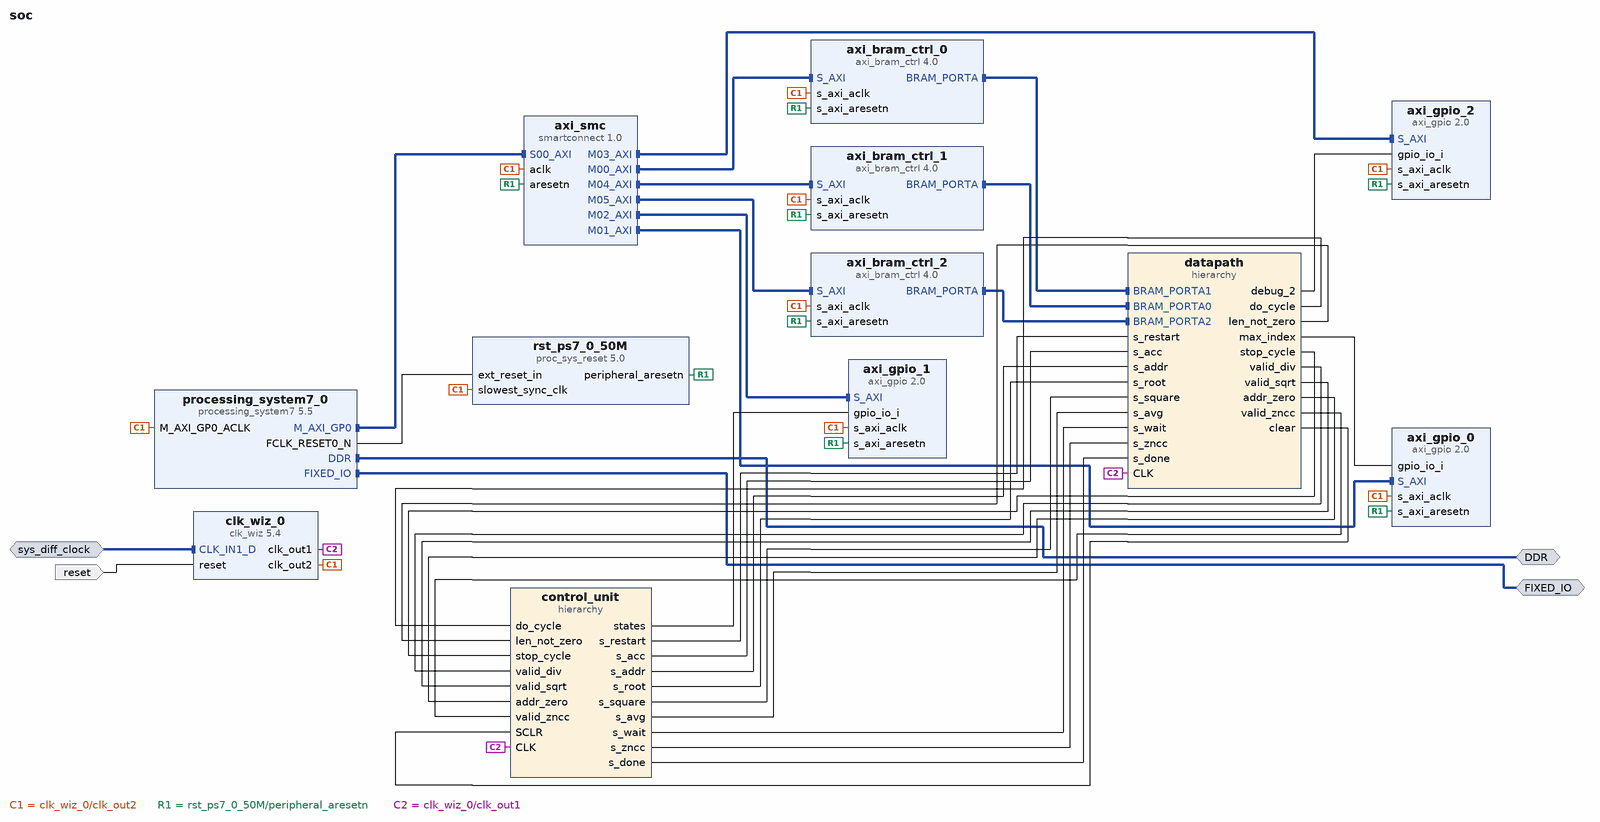
[diagram p0: block diagram of the top level]
# Vivado block design soc, xc7z045ffg900-2, Vivado 2017.3
create_bd_design soc

create_bd_intf_port -mode Master -vlnv xilinx.com:interface:ddrx_rtl:1.0 DDR
create_bd_intf_port -mode Master -vlnv xilinx.com:display_processing_system7:fixedio_rtl:1.0 FIXED_IO
create_bd_intf_port -mode Slave -vlnv xilinx.com:interface:diff_clock_rtl:1.0 sys_diff_clock
set_property -dict {CONFIG.FREQ_HZ 200000000} [get_bd_intf_ports sys_diff_clock]
create_bd_port -dir I -type rst reset
set_property -dict {CONFIG.POLARITY ACTIVE_HIGH} [get_bd_ports reset]

create_bd_cell -type ip -vlnv xilinx.com:ip:processing_system7:5.5 processing_system7_0
set_property -dict [list \
  CONFIG.PCW_UIPARAM_DDR_FREQ_MHZ 533.333313 \
  CONFIG.PCW_APU_PERIPHERAL_FREQMHZ 800 \
  CONFIG.PCW_SDIO_PERIPHERAL_FREQMHZ 50 \
  CONFIG.PCW_UART_PERIPHERAL_FREQMHZ 50 \
  CONFIG.PCW_I2C_PERIPHERAL_FREQMHZ 133.333328 \
  CONFIG.PCW_FPGA1_PERIPHERAL_FREQMHZ 250 \
  CONFIG.PCW_PRESET_BANK0_VOLTAGE {LVCMOS 1.8V} \
  CONFIG.PCW_PRESET_BANK1_VOLTAGE {LVCMOS 1.8V} \
  CONFIG.PCW_UIPARAM_DDR_PARTNO Custom \
  CONFIG.PCW_QSPI_PERIPHERAL_ENABLE 1 \
  CONFIG.PCW_QSPI_QSPI_IO {MIO 1 .. 6} \
  CONFIG.PCW_QSPI_GRP_SINGLE_SS_ENABLE 0 \
  CONFIG.PCW_DUAL_PARALLEL_QSPI_DATA_MODE x8 \
  CONFIG.PCW_QSPI_GRP_IO1_ENABLE 1 \
  CONFIG.PCW_QSPI_GRP_IO1_IO {MIO 0 9 .. 13} \
  CONFIG.PCW_QSPI_GRP_FBCLK_ENABLE 1 \
  CONFIG.PCW_QSPI_GRP_FBCLK_IO {MIO 8} \
  CONFIG.PCW_QSPI_INTERNAL_HIGHADDRESS 0xFDFFFFFF \
  CONFIG.PCW_ENET0_PERIPHERAL_ENABLE 1 \
  CONFIG.PCW_ENET0_ENET0_IO {MIO 16 .. 27} \
  CONFIG.PCW_ENET0_GRP_MDIO_ENABLE 1 \
  CONFIG.PCW_ENET0_GRP_MDIO_IO {MIO 52 .. 53} \
  CONFIG.PCW_ENET_RESET_ENABLE 1 \
  CONFIG.PCW_ENET_RESET_SELECT {Share reset pin} \
  CONFIG.PCW_ENET0_RESET_ENABLE 1 \
  CONFIG.PCW_ENET0_RESET_IO {MIO 47} \
  CONFIG.PCW_SD0_PERIPHERAL_ENABLE 1 \
  CONFIG.PCW_SD0_SD0_IO {MIO 40 .. 45} \
  CONFIG.PCW_SD0_GRP_CD_ENABLE 1 \
  CONFIG.PCW_SD0_GRP_CD_IO {MIO 14} \
  CONFIG.PCW_SD0_GRP_WP_ENABLE 1 \
  CONFIG.PCW_SD0_GRP_WP_IO {MIO 15} \
  CONFIG.PCW_UART1_PERIPHERAL_ENABLE 1 \
  CONFIG.PCW_UART1_UART1_IO {MIO 48 .. 49} \
  CONFIG.PCW_TTC0_PERIPHERAL_ENABLE 1 \
  CONFIG.PCW_TTC0_TTC0_IO EMIO \
  CONFIG.PCW_USB0_PERIPHERAL_ENABLE 1 \
  CONFIG.PCW_USB0_USB0_IO {MIO 28 .. 39} \
  CONFIG.PCW_USB_RESET_ENABLE 1 \
  CONFIG.PCW_USB_RESET_SELECT {Share reset pin} \
  CONFIG.PCW_USB0_RESET_ENABLE 1 \
  CONFIG.PCW_USB0_RESET_IO {MIO 7} \
  CONFIG.PCW_I2C0_PERIPHERAL_ENABLE 1 \
  CONFIG.PCW_I2C0_I2C0_IO {MIO 50 .. 51} \
  CONFIG.PCW_I2C0_GRP_INT_ENABLE 0 \
  CONFIG.PCW_I2C0_RESET_ENABLE 1 \
  CONFIG.PCW_I2C0_RESET_IO {MIO 46} \
  CONFIG.PCW_I2C_RESET_ENABLE 1 \
  CONFIG.PCW_I2C_RESET_SELECT {Share reset pin} \
  CONFIG.PCW_GPIO_MIO_GPIO_ENABLE 1 \
  CONFIG.PCW_GPIO_MIO_GPIO_IO MIO \
  CONFIG.PCW_ENET0_PERIPHERAL_FREQMHZ {100 Mbps} \
  CONFIG.preset ZC706 \
] [get_bd_cells processing_system7_0]
# 235 more settings of processing_system7_0 are not shown: defaults, MIO pin electricals, DDR timing, and values the tool derives
create_bd_cell -type ip -vlnv xilinx.com:ip:axi_bram_ctrl:4.0 axi_bram_ctrl_0
set_property -dict {CONFIG.SINGLE_PORT_BRAM 1} [get_bd_cells axi_bram_ctrl_0]
create_bd_cell -type ip -vlnv xilinx.com:ip:smartconnect:1.0 axi_smc
set_property -dict {CONFIG.NUM_MI 6 CONFIG.NUM_SI 1} [get_bd_cells axi_smc]
create_bd_cell -type ip -vlnv xilinx.com:ip:proc_sys_reset:5.0 rst_ps7_0_50M
create_bd_cell -type ip -vlnv xilinx.com:ip:axi_gpio:2.0 axi_gpio_0
set_property -dict {CONFIG.C_ALL_INPUTS 1} [get_bd_cells axi_gpio_0]
create_bd_cell -type ip -vlnv xilinx.com:ip:axi_gpio:2.0 axi_gpio_1
set_property -dict {CONFIG.C_ALL_INPUTS 1} [get_bd_cells axi_gpio_1]
create_bd_cell -type ip -vlnv xilinx.com:ip:axi_gpio:2.0 axi_gpio_2
set_property -dict {CONFIG.C_ALL_INPUTS 1} [get_bd_cells axi_gpio_2]
create_bd_cell -type ip -vlnv xilinx.com:ip:axi_bram_ctrl:4.0 axi_bram_ctrl_1
set_property -dict {CONFIG.SINGLE_PORT_BRAM 1} [get_bd_cells axi_bram_ctrl_1]
create_bd_cell -type ip -vlnv xilinx.com:ip:clk_wiz:5.4 clk_wiz_0
set_property -dict [list \
  CONFIG.PRIMITIVE MMCM \
  CONFIG.USE_INCLK_SWITCHOVER false \
  CONFIG.SECONDARY_IN_FREQ 100.000 \
  CONFIG.SECONDARY_SOURCE Single_ended_clock_capable_pin \
  CONFIG.CLKIN1_JITTER_PS 50.0 \
  CONFIG.CLKIN2_JITTER_PS 66.660000000000011 \
  CONFIG.CLKOUT2_USED true \
  CONFIG.NUM_OUT_CLKS 2 \
  CONFIG.CLKOUT1_REQUESTED_OUT_FREQ 300 \
  CONFIG.CLKOUT2_REQUESTED_OUT_FREQ 450 \
  CONFIG.PRIM_SOURCE Differential_clock_capable_pin \
  CONFIG.CLKOUT1_DRIVES BUFG \
  CONFIG.CLKOUT2_DRIVES BUFG \
  CONFIG.CLKOUT3_DRIVES BUFG \
  CONFIG.CLKOUT4_DRIVES BUFG \
  CONFIG.CLKOUT5_DRIVES BUFG \
  CONFIG.CLKOUT6_DRIVES BUFG \
  CONFIG.CLKOUT7_DRIVES BUFG \
  CONFIG.FEEDBACK_SOURCE FDBK_AUTO \
  CONFIG.MMCM_DIVCLK_DIVIDE 1 \
  CONFIG.MMCM_CLKFBOUT_MULT_F 4.500 \
  CONFIG.MMCM_CLKIN1_PERIOD 5.000 \
  CONFIG.MMCM_CLKIN2_PERIOD 10.0 \
  CONFIG.MMCM_COMPENSATION ZHOLD \
  CONFIG.MMCM_CLKOUT0_DIVIDE_F 3.000 \
  CONFIG.MMCM_CLKOUT1_DIVIDE 2 \
  CONFIG.USE_BOARD_FLOW true \
  CONFIG.CLK_IN1_BOARD_INTERFACE sys_diff_clock \
  CONFIG.CLK_IN2_BOARD_INTERFACE Custom \
  CONFIG.RESET_BOARD_INTERFACE reset \
  CONFIG.CLKOUT1_JITTER 89.301 \
  CONFIG.CLKOUT1_PHASE_ERROR 91.235 \
  CONFIG.CLKOUT2_JITTER 82.539 \
  CONFIG.CLKOUT2_PHASE_ERROR 91.235 \
] [get_bd_cells clk_wiz_0]
create_bd_cell -type hier control_unit
create_bd_cell -type hier datapath
create_bd_cell -type ip -vlnv xilinx.com:ip:axi_bram_ctrl:4.0 axi_bram_ctrl_2
set_property -dict {CONFIG.SINGLE_PORT_BRAM 1} [get_bd_cells axi_bram_ctrl_2]

# ---- hierarchy /control_unit ----
current_bd_instance /control_unit
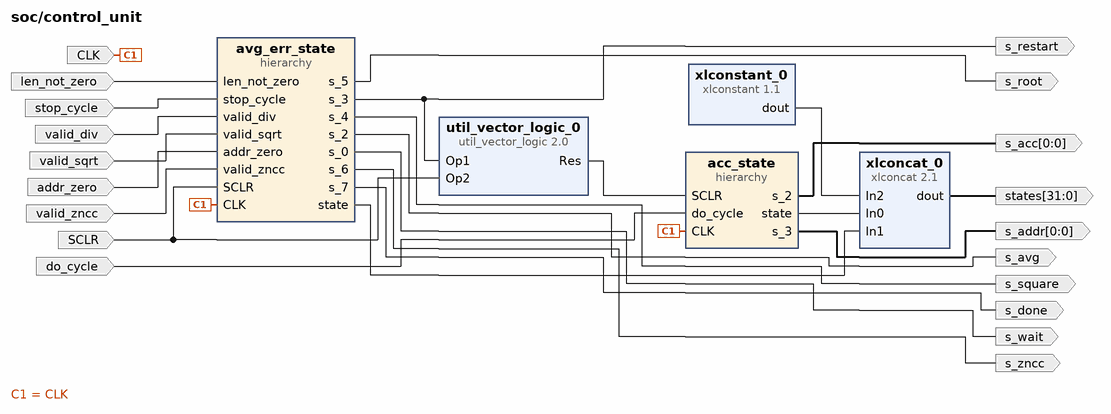
[diagram p1: block diagram inside /control_unit]
create_bd_pin -dir I -type clk CLK
create_bd_pin -dir I -type ce do_cycle
create_bd_pin -dir O s_restart
create_bd_pin -dir O -from 0 -to 0 s_acc
create_bd_pin -dir O -from 0 -to 0 s_addr
create_bd_pin -dir I len_not_zero
create_bd_pin -dir I stop_cycle
create_bd_pin -dir I valid_div
create_bd_pin -dir I valid_sqrt
create_bd_pin -dir O s_root
create_bd_pin -dir O s_square
create_bd_pin -dir O s_avg
create_bd_pin -dir O s_wait
create_bd_pin -dir I addr_zero
create_bd_pin -dir I valid_zncc
create_bd_pin -dir O s_zncc
create_bd_pin -dir O s_done
create_bd_pin -dir I SCLR
create_bd_pin -dir O -from 31 -to 0 states

create_bd_cell -type hier acc_state
create_bd_cell -type hier avg_err_state
create_bd_cell -type ip -vlnv xilinx.com:ip:util_vector_logic:2.0 util_vector_logic_0
set_property -dict {CONFIG.C_SIZE 1 CONFIG.C_OPERATION or} [get_bd_cells util_vector_logic_0]
create_bd_cell -type ip -vlnv xilinx.com:ip:xlconcat:2.1 xlconcat_0
set_property -dict {CONFIG.NUM_PORTS 3 CONFIG.IN0_WIDTH 2 CONFIG.IN1_WIDTH 4 CONFIG.IN2_WIDTH 26} [get_bd_cells xlconcat_0]
create_bd_cell -type ip -vlnv xilinx.com:ip:xlconstant:1.1 xlconstant_0
set_property -dict {CONFIG.CONST_WIDTH 26 CONFIG.CONST_VAL 0} [get_bd_cells xlconstant_0]

# ---- hierarchy /control_unit/acc_state ----
current_bd_instance /control_unit/acc_state
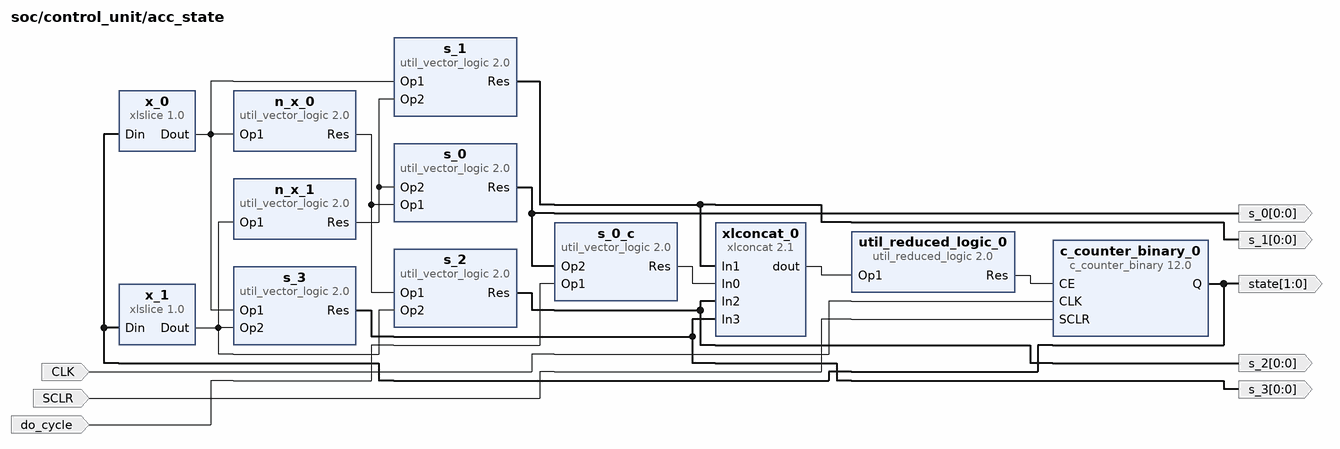
[diagram p2: block diagram inside /control_unit/acc_state]
create_bd_pin -dir I -type clk CLK
create_bd_pin -dir I -type ce do_cycle
create_bd_pin -dir I SCLR
create_bd_pin -dir O -from 0 -to 0 s_0
create_bd_pin -dir O -from 0 -to 0 s_1
create_bd_pin -dir O -from 0 -to 0 s_2
create_bd_pin -dir O -from 0 -to 0 s_3
create_bd_pin -dir O -from 1 -to 0 state

create_bd_cell -type ip -vlnv xilinx.com:ip:c_counter_binary:12.0 c_counter_binary_0
set_property -dict {CONFIG.Output_Width 2 CONFIG.CE true CONFIG.SCLR true} [get_bd_cells c_counter_binary_0]
create_bd_cell -type ip -vlnv xilinx.com:ip:xlslice:1.0 x_0
set_property -dict {CONFIG.DIN_TO 0 CONFIG.DIN_FROM 0 CONFIG.DIN_WIDTH 2} [get_bd_cells x_0]
create_bd_cell -type ip -vlnv xilinx.com:ip:xlslice:1.0 x_1
set_property -dict {CONFIG.DIN_TO 1 CONFIG.DIN_FROM 1 CONFIG.DIN_WIDTH 2 CONFIG.DOUT_WIDTH 1} [get_bd_cells x_1]
create_bd_cell -type ip -vlnv xilinx.com:ip:util_vector_logic:2.0 n_x_0
set_property -dict {CONFIG.C_SIZE 1 CONFIG.C_OPERATION not} [get_bd_cells n_x_0]
create_bd_cell -type ip -vlnv xilinx.com:ip:util_vector_logic:2.0 n_x_1
set_property -dict {CONFIG.C_SIZE 1 CONFIG.C_OPERATION not} [get_bd_cells n_x_1]
create_bd_cell -type ip -vlnv xilinx.com:ip:util_vector_logic:2.0 s_0
set_property -dict {CONFIG.C_SIZE 1 CONFIG.C_OPERATION and} [get_bd_cells s_0]
create_bd_cell -type ip -vlnv xilinx.com:ip:util_vector_logic:2.0 s_1
set_property -dict {CONFIG.C_SIZE 1 CONFIG.C_OPERATION and} [get_bd_cells s_1]
create_bd_cell -type ip -vlnv xilinx.com:ip:util_vector_logic:2.0 s_2
set_property -dict {CONFIG.C_SIZE 1 CONFIG.C_OPERATION and} [get_bd_cells s_2]
create_bd_cell -type ip -vlnv xilinx.com:ip:util_vector_logic:2.0 s_3
set_property -dict {CONFIG.C_SIZE 1 CONFIG.C_OPERATION and} [get_bd_cells s_3]
create_bd_cell -type ip -vlnv xilinx.com:ip:xlconcat:2.1 xlconcat_0
set_property -dict {CONFIG.NUM_PORTS 4} [get_bd_cells xlconcat_0]
create_bd_cell -type ip -vlnv xilinx.com:ip:util_reduced_logic:2.0 util_reduced_logic_0
set_property -dict {CONFIG.C_SIZE 4 CONFIG.C_OPERATION or} [get_bd_cells util_reduced_logic_0]
create_bd_cell -type ip -vlnv xilinx.com:ip:util_vector_logic:2.0 s_0_c
set_property -dict {CONFIG.C_SIZE 1 CONFIG.C_OPERATION and} [get_bd_cells s_0_c]

# ---- hierarchy /control_unit/avg_err_state ----
current_bd_instance /control_unit/avg_err_state
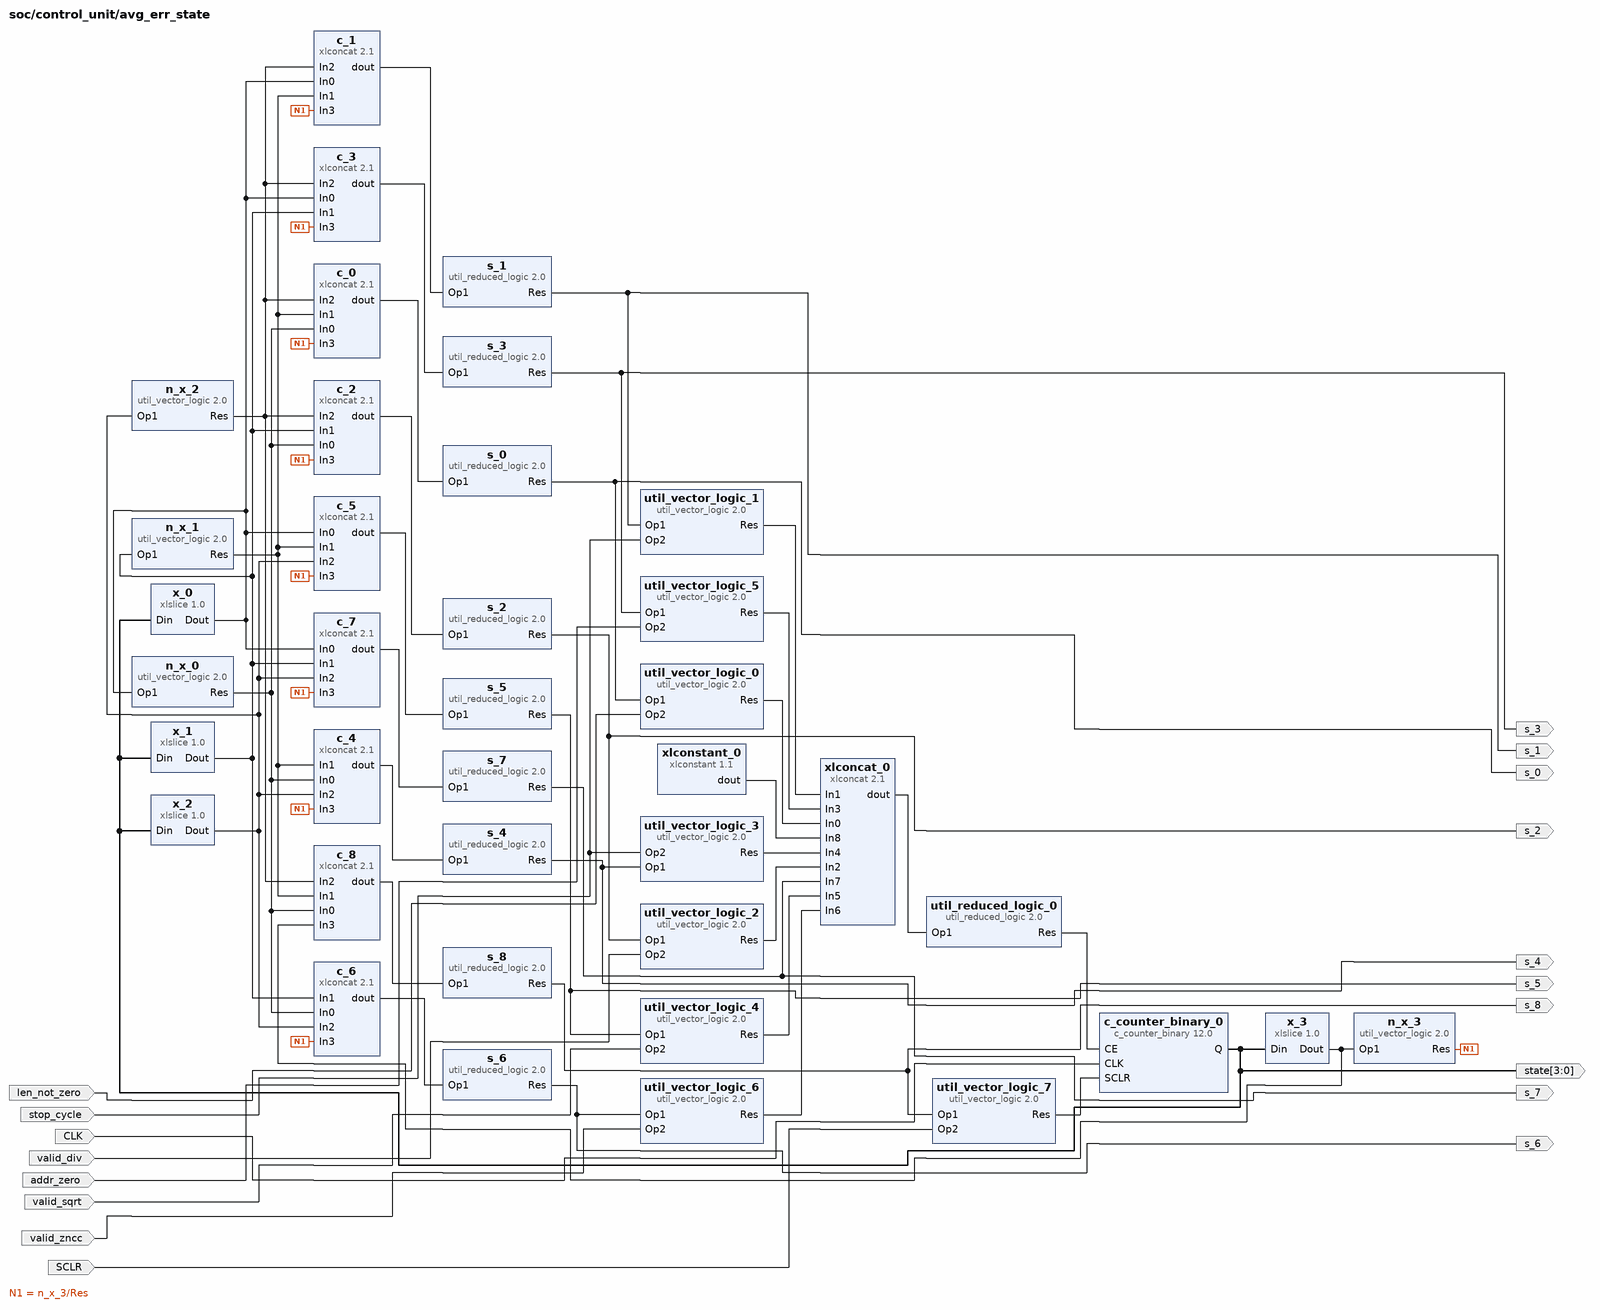
[diagram p3: block diagram inside /control_unit/avg_err_state]
create_bd_pin -dir I -type clk CLK
create_bd_pin -dir I len_not_zero
create_bd_pin -dir I stop_cycle
create_bd_pin -dir I valid_div
create_bd_pin -dir I valid_sqrt
create_bd_pin -dir O s_3
create_bd_pin -dir O s_8
create_bd_pin -dir O s_5
create_bd_pin -dir O s_4
create_bd_pin -dir O s_6
create_bd_pin -dir O s_7
create_bd_pin -dir O s_1
create_bd_pin -dir O s_2
create_bd_pin -dir O s_0
create_bd_pin -dir I addr_zero
create_bd_pin -dir I valid_zncc
create_bd_pin -dir I SCLR
create_bd_pin -dir O -from 3 -to 0 state

create_bd_cell -type ip -vlnv xilinx.com:ip:c_counter_binary:12.0 c_counter_binary_0
set_property -dict [list \
  CONFIG.Output_Width 4 \
  CONFIG.Increment_Value 1 \
  CONFIG.Restrict_Count false \
  CONFIG.CE true \
  CONFIG.SCLR true \
] [get_bd_cells c_counter_binary_0]
create_bd_cell -type ip -vlnv xilinx.com:ip:xlconcat:2.1 c_0
set_property -dict {CONFIG.NUM_PORTS 4} [get_bd_cells c_0]
create_bd_cell -type ip -vlnv xilinx.com:ip:util_reduced_logic:2.0 s_0
set_property -dict {CONFIG.C_SIZE 4 CONFIG.C_OPERATION and} [get_bd_cells s_0]
create_bd_cell -type ip -vlnv xilinx.com:ip:xlconcat:2.1 c_1
set_property -dict {CONFIG.NUM_PORTS 4} [get_bd_cells c_1]
create_bd_cell -type ip -vlnv xilinx.com:ip:util_reduced_logic:2.0 s_1
set_property -dict {CONFIG.C_SIZE 4 CONFIG.C_OPERATION and} [get_bd_cells s_1]
create_bd_cell -type ip -vlnv xilinx.com:ip:xlconcat:2.1 c_2
set_property -dict {CONFIG.NUM_PORTS 4} [get_bd_cells c_2]
create_bd_cell -type ip -vlnv xilinx.com:ip:util_reduced_logic:2.0 s_2
set_property -dict {CONFIG.C_SIZE 4 CONFIG.C_OPERATION and} [get_bd_cells s_2]
create_bd_cell -type ip -vlnv xilinx.com:ip:xlconcat:2.1 c_3
set_property -dict {CONFIG.NUM_PORTS 4} [get_bd_cells c_3]
create_bd_cell -type ip -vlnv xilinx.com:ip:util_reduced_logic:2.0 s_3
set_property -dict {CONFIG.C_SIZE 4 CONFIG.C_OPERATION and} [get_bd_cells s_3]
create_bd_cell -type ip -vlnv xilinx.com:ip:xlconcat:2.1 c_4
set_property -dict {CONFIG.NUM_PORTS 4} [get_bd_cells c_4]
create_bd_cell -type ip -vlnv xilinx.com:ip:util_reduced_logic:2.0 s_4
set_property -dict {CONFIG.C_SIZE 4 CONFIG.C_OPERATION and} [get_bd_cells s_4]
create_bd_cell -type ip -vlnv xilinx.com:ip:xlconcat:2.1 c_5
set_property -dict {CONFIG.NUM_PORTS 4} [get_bd_cells c_5]
create_bd_cell -type ip -vlnv xilinx.com:ip:util_reduced_logic:2.0 s_5
set_property -dict {CONFIG.C_SIZE 4 CONFIG.C_OPERATION and} [get_bd_cells s_5]
create_bd_cell -type ip -vlnv xilinx.com:ip:xlconcat:2.1 c_6
set_property -dict {CONFIG.NUM_PORTS 4} [get_bd_cells c_6]
create_bd_cell -type ip -vlnv xilinx.com:ip:util_reduced_logic:2.0 s_6
set_property -dict {CONFIG.C_SIZE 4 CONFIG.C_OPERATION and} [get_bd_cells s_6]
create_bd_cell -type ip -vlnv xilinx.com:ip:xlconcat:2.1 c_7
set_property -dict {CONFIG.NUM_PORTS 4} [get_bd_cells c_7]
create_bd_cell -type ip -vlnv xilinx.com:ip:util_reduced_logic:2.0 s_7
set_property -dict {CONFIG.C_SIZE 4 CONFIG.C_OPERATION and} [get_bd_cells s_7]
create_bd_cell -type ip -vlnv xilinx.com:ip:xlconcat:2.1 c_8
set_property -dict {CONFIG.NUM_PORTS 4} [get_bd_cells c_8]
create_bd_cell -type ip -vlnv xilinx.com:ip:util_reduced_logic:2.0 s_8
set_property -dict {CONFIG.C_SIZE 4 CONFIG.C_OPERATION and} [get_bd_cells s_8]
create_bd_cell -type ip -vlnv xilinx.com:ip:xlslice:1.0 x_0
set_property -dict {CONFIG.DIN_TO 0 CONFIG.DIN_FROM 0 CONFIG.DIN_WIDTH 4} [get_bd_cells x_0]
create_bd_cell -type ip -vlnv xilinx.com:ip:xlslice:1.0 x_1
set_property -dict {CONFIG.DIN_TO 1 CONFIG.DIN_FROM 1 CONFIG.DIN_WIDTH 4 CONFIG.DOUT_WIDTH 1} [get_bd_cells x_1]
create_bd_cell -type ip -vlnv xilinx.com:ip:xlslice:1.0 x_2
set_property -dict {CONFIG.DIN_TO 2 CONFIG.DIN_FROM 2 CONFIG.DIN_WIDTH 4 CONFIG.DOUT_WIDTH 1} [get_bd_cells x_2]
create_bd_cell -type ip -vlnv xilinx.com:ip:xlslice:1.0 x_3
set_property -dict {CONFIG.DIN_TO 3 CONFIG.DIN_FROM 3 CONFIG.DIN_WIDTH 4 CONFIG.DOUT_WIDTH 1} [get_bd_cells x_3]
create_bd_cell -type ip -vlnv xilinx.com:ip:util_vector_logic:2.0 n_x_0
set_property -dict {CONFIG.C_SIZE 1 CONFIG.C_OPERATION not} [get_bd_cells n_x_0]
create_bd_cell -type ip -vlnv xilinx.com:ip:util_vector_logic:2.0 n_x_1
set_property -dict {CONFIG.C_SIZE 1 CONFIG.C_OPERATION not} [get_bd_cells n_x_1]
create_bd_cell -type ip -vlnv xilinx.com:ip:util_vector_logic:2.0 n_x_3
set_property -dict {CONFIG.C_SIZE 1 CONFIG.C_OPERATION not} [get_bd_cells n_x_3]
create_bd_cell -type ip -vlnv xilinx.com:ip:util_vector_logic:2.0 n_x_2
set_property -dict {CONFIG.C_SIZE 1 CONFIG.C_OPERATION not} [get_bd_cells n_x_2]
create_bd_cell -type ip -vlnv xilinx.com:ip:xlconcat:2.1 xlconcat_0
set_property -dict {CONFIG.NUM_PORTS 9} [get_bd_cells xlconcat_0]
create_bd_cell -type ip -vlnv xilinx.com:ip:util_reduced_logic:2.0 util_reduced_logic_0
set_property -dict {CONFIG.C_SIZE 9 CONFIG.C_OPERATION or} [get_bd_cells util_reduced_logic_0]
create_bd_cell -type ip -vlnv xilinx.com:ip:util_vector_logic:2.0 util_vector_logic_0
set_property -dict {CONFIG.C_SIZE 1} [get_bd_cells util_vector_logic_0]
create_bd_cell -type ip -vlnv xilinx.com:ip:util_vector_logic:2.0 util_vector_logic_1
set_property -dict {CONFIG.C_SIZE 1} [get_bd_cells util_vector_logic_1]
create_bd_cell -type ip -vlnv xilinx.com:ip:util_vector_logic:2.0 util_vector_logic_2
set_property -dict {CONFIG.C_SIZE 1} [get_bd_cells util_vector_logic_2]
create_bd_cell -type ip -vlnv xilinx.com:ip:util_vector_logic:2.0 util_vector_logic_3
set_property -dict {CONFIG.C_SIZE 1} [get_bd_cells util_vector_logic_3]
create_bd_cell -type ip -vlnv xilinx.com:ip:util_vector_logic:2.0 util_vector_logic_4
set_property -dict {CONFIG.C_SIZE 1} [get_bd_cells util_vector_logic_4]
create_bd_cell -type ip -vlnv xilinx.com:ip:util_vector_logic:2.0 util_vector_logic_5
set_property -dict {CONFIG.C_SIZE 1} [get_bd_cells util_vector_logic_5]
create_bd_cell -type ip -vlnv xilinx.com:ip:util_vector_logic:2.0 util_vector_logic_6
set_property -dict {CONFIG.C_SIZE 1} [get_bd_cells util_vector_logic_6]
create_bd_cell -type ip -vlnv xilinx.com:ip:xlconstant:1.1 xlconstant_0
set_property -dict {CONFIG.CONST_WIDTH 1 CONFIG.CONST_VAL 0} [get_bd_cells xlconstant_0]
create_bd_cell -type ip -vlnv xilinx.com:ip:util_vector_logic:2.0 util_vector_logic_7
set_property -dict {CONFIG.C_SIZE 1 CONFIG.C_OPERATION or} [get_bd_cells util_vector_logic_7]

# ---- hierarchy /datapath ----
current_bd_instance /datapath
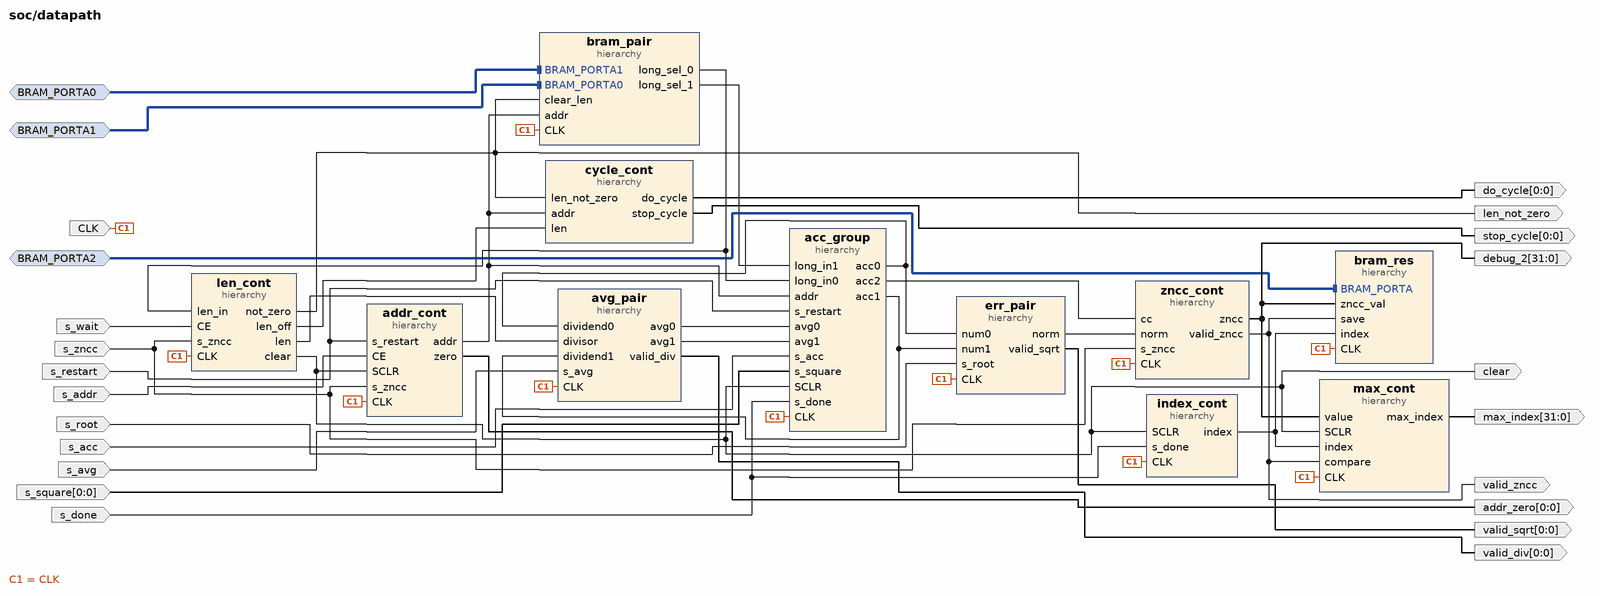
[diagram p4: block diagram inside /datapath]
create_bd_intf_pin -mode Slave -vlnv xilinx.com:interface:bram_rtl:1.0 BRAM_PORTA0
create_bd_intf_pin -mode Slave -vlnv xilinx.com:interface:bram_rtl:1.0 BRAM_PORTA1
create_bd_intf_pin -mode Slave -vlnv xilinx.com:interface:bram_rtl:1.0 BRAM_PORTA2
create_bd_pin -dir O -from 0 -to 0 valid_div
create_bd_pin -dir O -from 0 -to 0 valid_sqrt
create_bd_pin -dir I -type clk CLK
create_bd_pin -dir I s_root
create_bd_pin -dir O -from 0 -to 0 do_cycle
create_bd_pin -dir O -from 0 -to 0 stop_cycle
create_bd_pin -dir O len_not_zero
create_bd_pin -dir O -from 31 -to 0 max_index
create_bd_pin -dir I -type ce s_acc
create_bd_pin -dir I s_restart
create_bd_pin -dir I -from 0 -to 0 -type data s_square
create_bd_pin -dir I s_addr
create_bd_pin -dir O -from 0 -to 0 addr_zero
create_bd_pin -dir I s_wait
create_bd_pin -dir I s_avg
create_bd_pin -dir O -from 31 -to 0 debug_2
create_bd_pin -dir I s_zncc
create_bd_pin -dir O valid_zncc
create_bd_pin -dir I s_done
create_bd_pin -dir O clear

create_bd_cell -type hier cycle_cont
create_bd_cell -type hier addr_cont
create_bd_cell -type hier len_cont
create_bd_cell -type hier bram_pair
create_bd_cell -type hier avg_pair
create_bd_cell -type hier acc_group
create_bd_cell -type hier err_pair
create_bd_cell -type hier zncc_cont
create_bd_cell -type hier bram_res
create_bd_cell -type hier index_cont
create_bd_cell -type hier max_cont

# ---- hierarchy /datapath/cycle_cont ----
current_bd_instance /datapath/cycle_cont
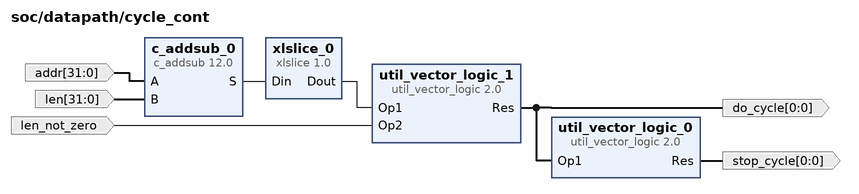
[diagram p5: block diagram inside /datapath/cycle_cont]
create_bd_pin -dir I -from 31 -to 0 -type data addr
create_bd_pin -dir I -from 31 -to 0 -type data len
create_bd_pin -dir O -from 0 -to 0 do_cycle
create_bd_pin -dir O -from 0 -to 0 stop_cycle
create_bd_pin -dir I len_not_zero

create_bd_cell -type ip -vlnv xilinx.com:ip:c_addsub:12.0 c_addsub_0
set_property -dict [list \
  CONFIG.A_Type Unsigned \
  CONFIG.B_Type Unsigned \
  CONFIG.A_Width 32 \
  CONFIG.B_Width 32 \
  CONFIG.Add_Mode Subtract \
  CONFIG.Out_Width 32 \
  CONFIG.Latency 0 \
  CONFIG.B_Value 00000000000000000000000000000000 \
  CONFIG.CE false \
] [get_bd_cells c_addsub_0]
create_bd_cell -type ip -vlnv xilinx.com:ip:xlslice:1.0 xlslice_0
set_property -dict {CONFIG.DIN_TO 31 CONFIG.DIN_FROM 31 CONFIG.DOUT_WIDTH 1} [get_bd_cells xlslice_0]
create_bd_cell -type ip -vlnv xilinx.com:ip:util_vector_logic:2.0 util_vector_logic_0
set_property -dict {CONFIG.C_SIZE 1 CONFIG.C_OPERATION not} [get_bd_cells util_vector_logic_0]
create_bd_cell -type ip -vlnv xilinx.com:ip:util_vector_logic:2.0 util_vector_logic_1
set_property -dict {CONFIG.C_SIZE 1} [get_bd_cells util_vector_logic_1]

# ---- hierarchy /datapath/addr_cont ----
current_bd_instance /datapath/addr_cont
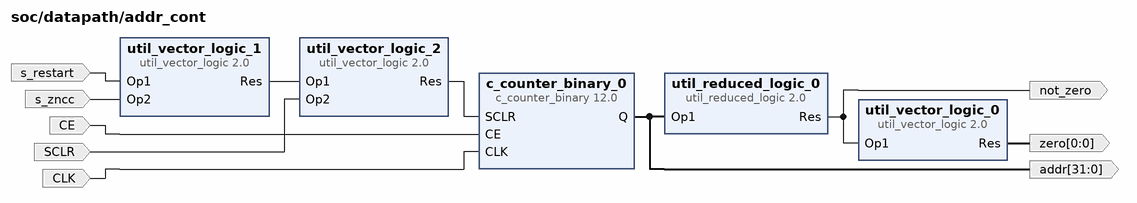
[diagram p6: block diagram inside /datapath/addr_cont]
create_bd_pin -dir I -type clk s_restart
create_bd_pin -dir O -from 31 -to 0 -type data addr
create_bd_pin -dir I CE
create_bd_pin -dir O not_zero
create_bd_pin -dir O -from 0 -to 0 zero
create_bd_pin -dir I CLK
create_bd_pin -dir I s_zncc
create_bd_pin -dir I SCLR

create_bd_cell -type ip -vlnv xilinx.com:ip:c_counter_binary:12.0 c_counter_binary_0
set_property -dict [list \
  CONFIG.Implementation Fabric \
  CONFIG.Output_Width 32 \
  CONFIG.CE true \
  CONFIG.SCLR true \
] [get_bd_cells c_counter_binary_0]
create_bd_cell -type ip -vlnv xilinx.com:ip:util_reduced_logic:2.0 util_reduced_logic_0
set_property -dict {CONFIG.C_SIZE 32 CONFIG.C_OPERATION or} [get_bd_cells util_reduced_logic_0]
create_bd_cell -type ip -vlnv xilinx.com:ip:util_vector_logic:2.0 util_vector_logic_0
set_property -dict {CONFIG.C_SIZE 1 CONFIG.C_OPERATION not} [get_bd_cells util_vector_logic_0]
create_bd_cell -type ip -vlnv xilinx.com:ip:util_vector_logic:2.0 util_vector_logic_1
set_property -dict {CONFIG.C_SIZE 1 CONFIG.C_OPERATION or} [get_bd_cells util_vector_logic_1]
create_bd_cell -type ip -vlnv xilinx.com:ip:util_vector_logic:2.0 util_vector_logic_2
set_property -dict {CONFIG.C_SIZE 1 CONFIG.C_OPERATION or} [get_bd_cells util_vector_logic_2]

# ---- hierarchy /datapath/len_cont ----
current_bd_instance /datapath/len_cont
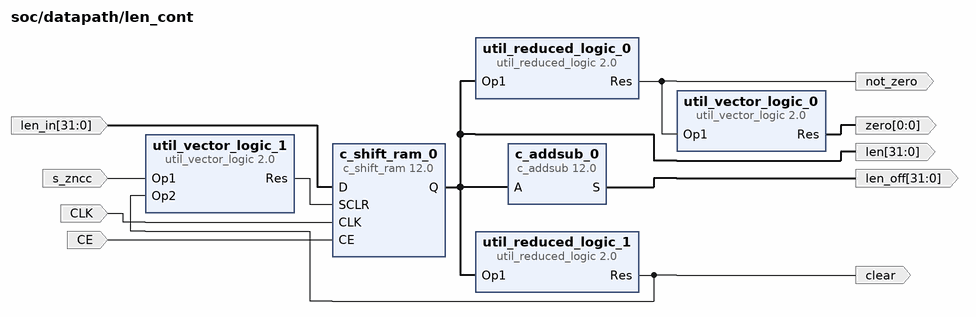
[diagram p7: block diagram inside /datapath/len_cont]
create_bd_pin -dir I -from 31 -to 0 -type data len_in
create_bd_pin -dir I -type clk CLK
create_bd_pin -dir O -from 31 -to 0 len
create_bd_pin -dir I CE
create_bd_pin -dir I s_zncc
create_bd_pin -dir O not_zero
create_bd_pin -dir O -from 0 -to 0 zero
create_bd_pin -dir O -from 31 -to 0 len_off
create_bd_pin -dir O clear

create_bd_cell -type ip -vlnv xilinx.com:ip:c_shift_ram:12.0 c_shift_ram_0
set_property -dict [list \
  CONFIG.CE true \
  CONFIG.Width 32 \
  CONFIG.Depth 1 \
  CONFIG.DefaultData 00000000000000000000000000000000 \
  CONFIG.AsyncInitVal 00000000000000000000000000000000 \
  CONFIG.SCLR true \
] [get_bd_cells c_shift_ram_0]
create_bd_cell -type ip -vlnv xilinx.com:ip:util_reduced_logic:2.0 util_reduced_logic_0
set_property -dict {CONFIG.C_SIZE 32 CONFIG.C_OPERATION or} [get_bd_cells util_reduced_logic_0]
create_bd_cell -type ip -vlnv xilinx.com:ip:util_vector_logic:2.0 util_vector_logic_0
set_property -dict {CONFIG.C_SIZE 1 CONFIG.C_OPERATION not} [get_bd_cells util_vector_logic_0]
create_bd_cell -type ip -vlnv xilinx.com:ip:c_addsub:12.0 c_addsub_0
set_property -dict [list \
  CONFIG.A_Type Unsigned \
  CONFIG.B_Type Unsigned \
  CONFIG.A_Width 32 \
  CONFIG.Out_Width 32 \
  CONFIG.Latency 0 \
  CONFIG.B_Constant true \
  CONFIG.B_Value 000000000000100 \
  CONFIG.CE false \
] [get_bd_cells c_addsub_0]
create_bd_cell -type ip -vlnv xilinx.com:ip:util_reduced_logic:2.0 util_reduced_logic_1
set_property -dict {CONFIG.C_SIZE 32 CONFIG.C_OPERATION and} [get_bd_cells util_reduced_logic_1]
create_bd_cell -type ip -vlnv xilinx.com:ip:util_vector_logic:2.0 util_vector_logic_1
set_property -dict {CONFIG.C_SIZE 1 CONFIG.C_OPERATION or} [get_bd_cells util_vector_logic_1]

# ---- hierarchy /datapath/bram_pair ----
current_bd_instance /datapath/bram_pair
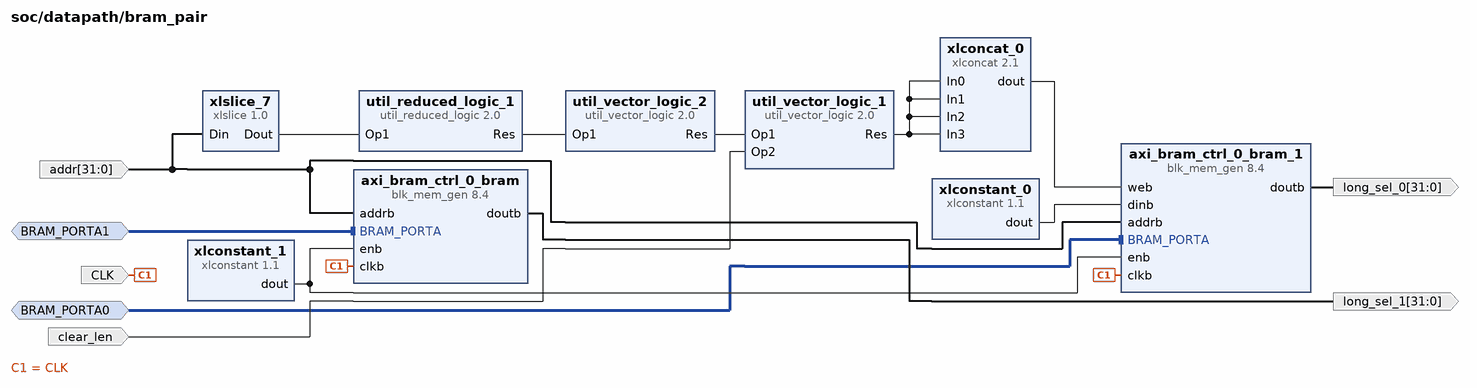
[diagram p8: block diagram inside /datapath/bram_pair]
create_bd_intf_pin -mode Slave -vlnv xilinx.com:interface:bram_rtl:1.0 BRAM_PORTA0
create_bd_intf_pin -mode Slave -vlnv xilinx.com:interface:bram_rtl:1.0 BRAM_PORTA1
create_bd_pin -dir I -type clk CLK
create_bd_pin -dir I -from 31 -to 0 addr
create_bd_pin -dir O -from 31 -to 0 long_sel_0
create_bd_pin -dir O -from 31 -to 0 long_sel_1
create_bd_pin -dir I clear_len

create_bd_cell -type ip -vlnv xilinx.com:ip:blk_mem_gen:8.4 axi_bram_ctrl_0_bram
set_property -dict {CONFIG.Memory_Type True_Dual_Port_RAM} [get_bd_cells axi_bram_ctrl_0_bram]
create_bd_cell -type ip -vlnv xilinx.com:ip:xlconstant:1.1 xlconstant_1
create_bd_cell -type ip -vlnv xilinx.com:ip:blk_mem_gen:8.4 axi_bram_ctrl_0_bram_1
set_property -dict {CONFIG.Memory_Type True_Dual_Port_RAM} [get_bd_cells axi_bram_ctrl_0_bram_1]
create_bd_cell -type ip -vlnv xilinx.com:ip:xlconstant:1.1 xlconstant_0
set_property -dict {CONFIG.CONST_WIDTH 32 CONFIG.CONST_VAL 0} [get_bd_cells xlconstant_0]
create_bd_cell -type ip -vlnv xilinx.com:ip:xlconcat:2.1 xlconcat_0
set_property -dict {CONFIG.NUM_PORTS 4} [get_bd_cells xlconcat_0]
create_bd_cell -type ip -vlnv xilinx.com:ip:util_reduced_logic:2.0 util_reduced_logic_1
set_property -dict {CONFIG.C_SIZE 30 CONFIG.C_OPERATION or} [get_bd_cells util_reduced_logic_1]
create_bd_cell -type ip -vlnv xilinx.com:ip:util_vector_logic:2.0 util_vector_logic_1
set_property -dict {CONFIG.C_SIZE 1} [get_bd_cells util_vector_logic_1]
create_bd_cell -type ip -vlnv xilinx.com:ip:xlslice:1.0 xlslice_7
set_property -dict {CONFIG.DIN_TO 2 CONFIG.DIN_FROM 31 CONFIG.DOUT_WIDTH 30} [get_bd_cells xlslice_7]
create_bd_cell -type ip -vlnv xilinx.com:ip:util_vector_logic:2.0 util_vector_logic_2
set_property -dict {CONFIG.C_SIZE 1 CONFIG.C_OPERATION not} [get_bd_cells util_vector_logic_2]

# ---- hierarchy /datapath/avg_pair ----
current_bd_instance /datapath/avg_pair
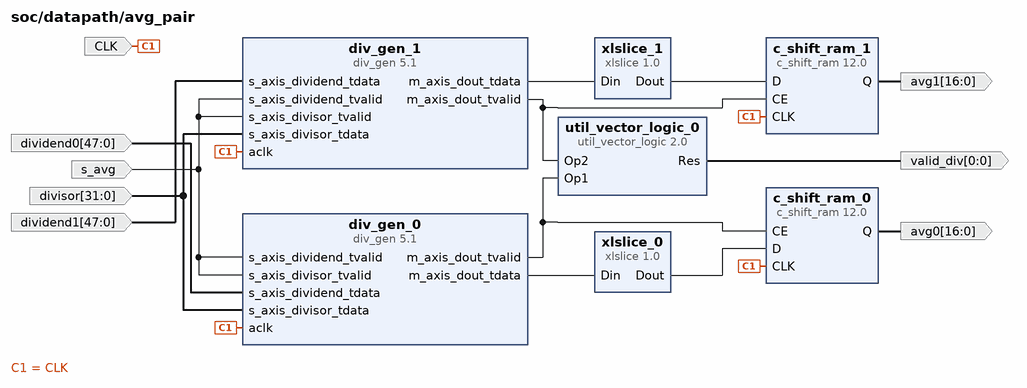
[diagram p9: block diagram inside /datapath/avg_pair]
create_bd_pin -dir I CLK
create_bd_pin -dir O -from 16 -to 0 avg0
create_bd_pin -dir O -from 16 -to 0 avg1
create_bd_pin -dir I s_avg
create_bd_pin -dir I -from 31 -to 0 divisor
create_bd_pin -dir I -from 47 -to 0 dividend0
create_bd_pin -dir I -from 47 -to 0 dividend1
create_bd_pin -dir O -from 0 -to 0 valid_div

create_bd_cell -type ip -vlnv xilinx.com:ip:div_gen:5.1 div_gen_0
set_property -dict [list \
  CONFIG.algorithm_type High_Radix \
  CONFIG.dividend_and_quotient_width 48 \
  CONFIG.divisor_width 32 \
  CONFIG.remainder_type Fractional \
  CONFIG.fractional_width 32 \
  CONFIG.latency_configuration Automatic \
  CONFIG.latency 39 \
] [get_bd_cells div_gen_0]
create_bd_cell -type ip -vlnv xilinx.com:ip:xlslice:1.0 xlslice_0
set_property -dict {CONFIG.DIN_TO 32 CONFIG.DIN_FROM 48 CONFIG.DIN_WIDTH 80 CONFIG.DOUT_WIDTH 17} [get_bd_cells xlslice_0]
create_bd_cell -type ip -vlnv xilinx.com:ip:div_gen:5.1 div_gen_1
set_property -dict [list \
  CONFIG.algorithm_type High_Radix \
  CONFIG.dividend_and_quotient_width 48 \
  CONFIG.divisor_width 32 \
  CONFIG.remainder_type Fractional \
  CONFIG.fractional_width 32 \
  CONFIG.latency_configuration Automatic \
  CONFIG.latency 39 \
] [get_bd_cells div_gen_1]
create_bd_cell -type ip -vlnv xilinx.com:ip:xlslice:1.0 xlslice_1
set_property -dict {CONFIG.DIN_TO 32 CONFIG.DIN_FROM 48 CONFIG.DIN_WIDTH 80 CONFIG.DOUT_WIDTH 17} [get_bd_cells xlslice_1]
create_bd_cell -type ip -vlnv xilinx.com:ip:c_shift_ram:12.0 c_shift_ram_0
set_property -dict [list \
  CONFIG.CE true \
  CONFIG.Width 17 \
  CONFIG.Depth 1 \
  CONFIG.DefaultData 00000000000000000 \
  CONFIG.AsyncInitVal 00000000000000000 \
  CONFIG.SCLR true \
] [get_bd_cells c_shift_ram_0]
create_bd_cell -type ip -vlnv xilinx.com:ip:c_shift_ram:12.0 c_shift_ram_1
set_property -dict [list \
  CONFIG.CE true \
  CONFIG.Width 17 \
  CONFIG.Depth 1 \
  CONFIG.DefaultData 00000000000000000 \
  CONFIG.AsyncInitVal 00000000000000000 \
  CONFIG.SCLR true \
] [get_bd_cells c_shift_ram_1]
create_bd_cell -type ip -vlnv xilinx.com:ip:util_vector_logic:2.0 util_vector_logic_0
set_property -dict {CONFIG.C_SIZE 1} [get_bd_cells util_vector_logic_0]

# ---- hierarchy /datapath/acc_group ----
current_bd_instance /datapath/acc_group
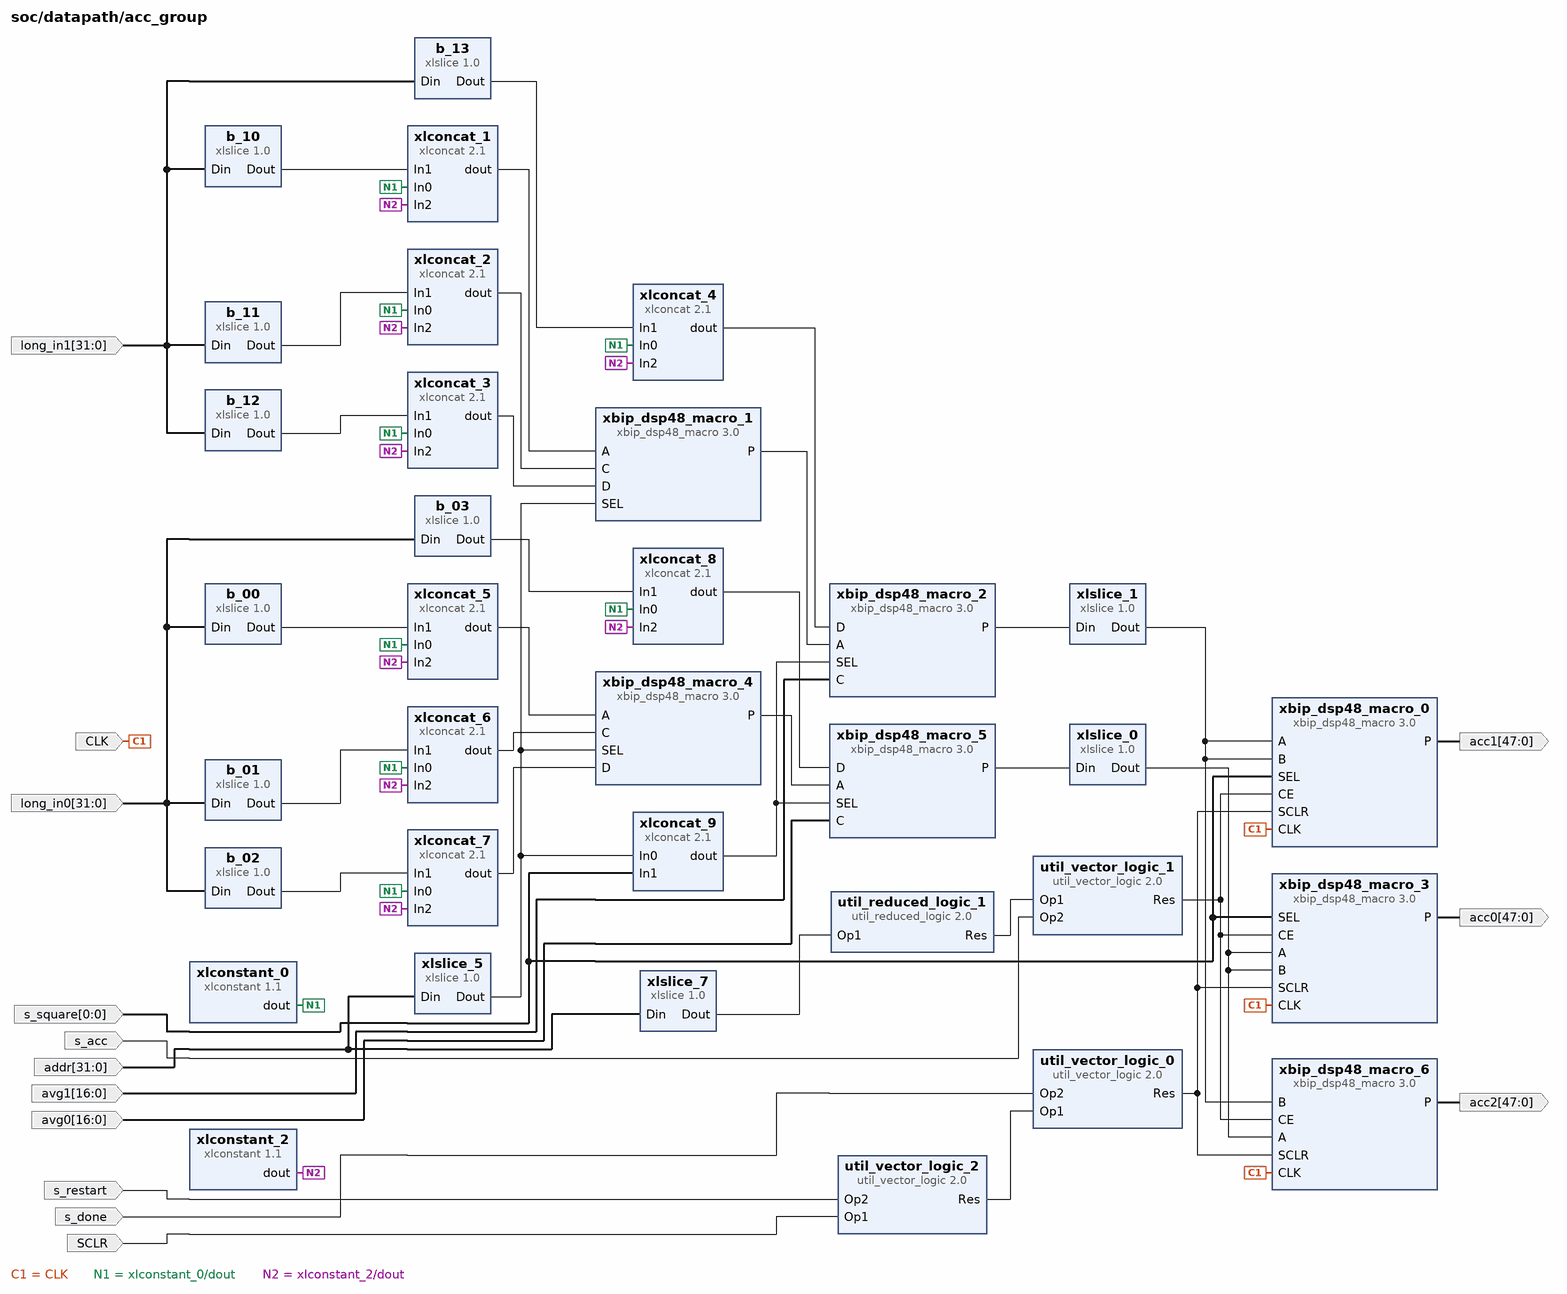
[diagram p10: block diagram inside /datapath/acc_group]
create_bd_pin -dir I -type clk CLK
create_bd_pin -dir I -type ce s_acc
create_bd_pin -dir I -type rst s_restart
create_bd_pin -dir I -from 0 -to 0 -type data s_square
create_bd_pin -dir I -from 31 -to 0 addr
create_bd_pin -dir I -from 16 -to 0 avg1
create_bd_pin -dir I -from 16 -to 0 avg0
create_bd_pin -dir I -from 31 -to 0 long_in1
create_bd_pin -dir I -from 31 -to 0 long_in0
create_bd_pin -dir O -from 47 -to 0 acc0
create_bd_pin -dir O -from 47 -to 0 acc1
create_bd_pin -dir O -from 47 -to 0 acc2
create_bd_pin -dir I s_done
create_bd_pin -dir I SCLR

create_bd_cell -type ip -vlnv xilinx.com:ip:xbip_dsp48_macro:3.0 xbip_dsp48_macro_0
set_property -dict [list \
  CONFIG.instruction1 P+A \
  CONFIG.instruction2 {P+A*B} \
  CONFIG.pipeline_options By_Tier \
  CONFIG.tier_6 true \
  CONFIG.areg_1 false \
  CONFIG.areg_2 false \
  CONFIG.areg_3 false \
  CONFIG.areg_4 false \
  CONFIG.breg_1 false \
  CONFIG.breg_2 false \
  CONFIG.breg_3 false \
  CONFIG.breg_4 false \
  CONFIG.creg_3 false \
  CONFIG.creg_4 false \
  CONFIG.creg_5 false \
  CONFIG.opreg_1 false \
  CONFIG.opreg_2 false \
  CONFIG.opreg_3 false \
  CONFIG.opreg_4 false \
  CONFIG.opreg_5 false \
  CONFIG.mreg_5 false \
  CONFIG.preg_6 true \
  CONFIG.has_ce true \
  CONFIG.has_sclr true \
] [get_bd_cells xbip_dsp48_macro_0]
create_bd_cell -type ip -vlnv xilinx.com:ip:xbip_dsp48_macro:3.0 xbip_dsp48_macro_3
set_property -dict [list \
  CONFIG.instruction1 P+A \
  CONFIG.instruction2 {P+A*B} \
  CONFIG.pipeline_options By_Tier \
  CONFIG.tier_6 true \
  CONFIG.areg_1 false \
  CONFIG.areg_2 false \
  CONFIG.areg_3 false \
  CONFIG.areg_4 false \
  CONFIG.breg_1 false \
  CONFIG.breg_2 false \
  CONFIG.breg_3 false \
  CONFIG.breg_4 false \
  CONFIG.creg_3 false \
  CONFIG.creg_4 false \
  CONFIG.creg_5 false \
  CONFIG.opreg_1 false \
  CONFIG.opreg_2 false \
  CONFIG.opreg_3 false \
  CONFIG.opreg_4 false \
  CONFIG.opreg_5 false \
  CONFIG.mreg_5 false \
  CONFIG.preg_6 true \
  CONFIG.has_ce true \
  CONFIG.has_sclr true \
] [get_bd_cells xbip_dsp48_macro_3]
create_bd_cell -type ip -vlnv xilinx.com:ip:xbip_dsp48_macro:3.0 xbip_dsp48_macro_6
set_property -dict [list \
  CONFIG.instruction1 {P+A*B} \
  CONFIG.instruction2 {#} \
  CONFIG.pipeline_options By_Tier \
  CONFIG.tier_6 true \
  CONFIG.areg_1 false \
  CONFIG.areg_2 false \
  CONFIG.areg_3 false \
  CONFIG.areg_4 false \
  CONFIG.breg_1 false \
  CONFIG.breg_2 false \
  CONFIG.breg_3 false \
  CONFIG.breg_4 false \
  CONFIG.creg_3 false \
  CONFIG.creg_4 false \
  CONFIG.creg_5 false \
  CONFIG.opreg_1 false \
  CONFIG.opreg_2 false \
  CONFIG.opreg_3 false \
  CONFIG.opreg_4 false \
  CONFIG.opreg_5 false \
  CONFIG.mreg_5 false \
  CONFIG.preg_6 true \
  CONFIG.has_ce true \
  CONFIG.has_sclr true \
] [get_bd_cells xbip_dsp48_macro_6]
create_bd_cell -type ip -vlnv xilinx.com:ip:xbip_dsp48_macro:3.0 xbip_dsp48_macro_4
set_property -dict [list \
  CONFIG.instruction1 A \
  CONFIG.instruction2 C \
  CONFIG.instruction3 D \
  CONFIG.instruction4 D \
  CONFIG.pipeline_options By_Tier \
  CONFIG.dreg_1 false \
  CONFIG.dreg_2 false \
  CONFIG.dreg_3 false \
  CONFIG.areg_1 false \
  CONFIG.areg_2 false \
  CONFIG.areg_3 false \
  CONFIG.areg_4 false \
  CONFIG.breg_3 false \
  CONFIG.breg_4 false \
  CONFIG.creg_1 false \
  CONFIG.creg_2 false \
  CONFIG.creg_3 false \
  CONFIG.creg_4 false \
  CONFIG.creg_5 false \
  CONFIG.opreg_1 false \
  CONFIG.opreg_2 false \
  CONFIG.opreg_3 false \
  CONFIG.opreg_4 false \
  CONFIG.opreg_5 false \
  CONFIG.mreg_5 false \
  CONFIG.preg_6 false \
  CONFIG.d_width 17 \
  CONFIG.a_width 17 \
  CONFIG.c_width 17 \
  CONFIG.p_full_width 18 \
  CONFIG.p_width 18 \
  CONFIG.p_binarywidth 0 \
] [get_bd_cells xbip_dsp48_macro_4]
create_bd_cell -type ip -vlnv xilinx.com:ip:xbip_dsp48_macro:3.0 xbip_dsp48_macro_5
set_property -dict [list \
  CONFIG.instruction1 A \
  CONFIG.instruction2 A \
  CONFIG.instruction3 A \
  CONFIG.instruction4 D \
  CONFIG.instruction5 A-C \
  CONFIG.instruction6 A-C \
  CONFIG.instruction7 A-C \
  CONFIG.instruction8 D-C \
  CONFIG.pipeline_options By_Tier \
  CONFIG.dreg_1 false \
  CONFIG.dreg_2 false \
  CONFIG.dreg_3 false \
  CONFIG.areg_1 false \
  CONFIG.areg_2 false \
  CONFIG.areg_3 false \
  CONFIG.areg_4 false \
  CONFIG.breg_3 false \
  CONFIG.breg_4 false \
  CONFIG.creg_1 false \
  CONFIG.creg_2 false \
  CONFIG.creg_3 false \
  CONFIG.creg_4 false \
  CONFIG.creg_5 false \
  CONFIG.opreg_1 false \
  CONFIG.opreg_2 false \
  CONFIG.opreg_3 false \
  CONFIG.opreg_4 false \
  CONFIG.opreg_5 false \
  CONFIG.mreg_5 false \
  CONFIG.preg_6 false \
  CONFIG.d_width 17 \
  CONFIG.a_width 18 \
  CONFIG.a_binarywidth 0 \
  CONFIG.c_width 17 \
  CONFIG.c_binarywidth 0 \
  CONFIG.p_full_width 19 \
  CONFIG.p_width 19 \
  CONFIG.p_binarywidth 0 \
] [get_bd_cells xbip_dsp48_macro_5]
create_bd_cell -type ip -vlnv xilinx.com:ip:xbip_dsp48_macro:3.0 xbip_dsp48_macro_1
set_property -dict [list \
  CONFIG.instruction1 A \
  CONFIG.instruction2 C \
  CONFIG.instruction3 D \
  CONFIG.instruction4 D \
  CONFIG.pipeline_options By_Tier \
  CONFIG.dreg_1 false \
  CONFIG.dreg_2 false \
  CONFIG.dreg_3 false \
  CONFIG.areg_1 false \
  CONFIG.areg_2 false \
  CONFIG.areg_3 false \
  CONFIG.areg_4 false \
  CONFIG.breg_3 false \
  CONFIG.breg_4 false \
  CONFIG.creg_1 false \
  CONFIG.creg_2 false \
  CONFIG.creg_3 false \
  CONFIG.creg_4 false \
  CONFIG.creg_5 false \
  CONFIG.opreg_1 false \
  CONFIG.opreg_2 false \
  CONFIG.opreg_3 false \
  CONFIG.opreg_4 false \
  CONFIG.opreg_5 false \
  CONFIG.mreg_5 false \
  CONFIG.preg_6 false \
  CONFIG.d_width 17 \
  CONFIG.a_width 17 \
  CONFIG.c_width 17 \
  CONFIG.p_full_width 18 \
  CONFIG.p_width 18 \
  CONFIG.p_binarywidth 0 \
] [get_bd_cells xbip_dsp48_macro_1]
create_bd_cell -type ip -vlnv xilinx.com:ip:xbip_dsp48_macro:3.0 xbip_dsp48_macro_2
set_property -dict [list \
  CONFIG.instruction1 A \
  CONFIG.instruction2 A \
  CONFIG.instruction3 A \
  CONFIG.instruction4 D \
  CONFIG.instruction5 A-C \
  CONFIG.instruction6 A-C \
  CONFIG.instruction7 A-C \
  CONFIG.instruction8 D-C \
  CONFIG.pipeline_options By_Tier \
  CONFIG.dreg_1 false \
  CONFIG.dreg_2 false \
  CONFIG.dreg_3 false \
  CONFIG.areg_1 false \
  CONFIG.areg_2 false \
  CONFIG.areg_3 false \
  CONFIG.areg_4 false \
  CONFIG.breg_3 false \
  CONFIG.breg_4 false \
  CONFIG.creg_1 false \
  CONFIG.creg_2 false \
  CONFIG.creg_3 false \
  CONFIG.creg_4 false \
  CONFIG.creg_5 false \
  CONFIG.opreg_1 false \
  CONFIG.opreg_2 false \
  CONFIG.opreg_3 false \
  CONFIG.opreg_4 false \
  CONFIG.opreg_5 false \
  CONFIG.mreg_5 false \
  CONFIG.preg_6 false \
  CONFIG.d_width 17 \
  CONFIG.a_width 18 \
  CONFIG.a_binarywidth 0 \
  CONFIG.c_width 17 \
  CONFIG.c_binarywidth 0 \
  CONFIG.p_full_width 19 \
  CONFIG.p_width 19 \
  CONFIG.p_binarywidth 0 \
] [get_bd_cells xbip_dsp48_macro_2]
create_bd_cell -type ip -vlnv xilinx.com:ip:xlslice:1.0 b_11
set_property -dict {CONFIG.DIN_TO 8 CONFIG.DIN_FROM 15 CONFIG.DOUT_WIDTH 8} [get_bd_cells b_11]
create_bd_cell -type ip -vlnv xilinx.com:ip:xlslice:1.0 b_12
set_property -dict {CONFIG.DIN_TO 16 CONFIG.DIN_FROM 23 CONFIG.DOUT_WIDTH 8} [get_bd_cells b_12]
create_bd_cell -type ip -vlnv xilinx.com:ip:xlslice:1.0 b_13
set_property -dict {CONFIG.DIN_TO 24 CONFIG.DIN_FROM 31 CONFIG.DOUT_WIDTH 8} [get_bd_cells b_13]
create_bd_cell -type ip -vlnv xilinx.com:ip:xlslice:1.0 b_00
set_property -dict {CONFIG.DIN_FROM 7 CONFIG.DOUT_WIDTH 8} [get_bd_cells b_00]
create_bd_cell -type ip -vlnv xilinx.com:ip:xlslice:1.0 b_01
set_property -dict {CONFIG.DIN_TO 8 CONFIG.DIN_FROM 15 CONFIG.DOUT_WIDTH 8} [get_bd_cells b_01]
create_bd_cell -type ip -vlnv xilinx.com:ip:xlconstant:1.1 xlconstant_0
set_property -dict {CONFIG.CONST_WIDTH 8 CONFIG.CONST_VAL 0} [get_bd_cells xlconstant_0]
create_bd_cell -type ip -vlnv xilinx.com:ip:xlconcat:2.1 xlconcat_1
set_property -dict {CONFIG.NUM_PORTS 3 CONFIG.IN0_WIDTH 8 CONFIG.IN1_WIDTH 8} [get_bd_cells xlconcat_1]
create_bd_cell -type ip -vlnv xilinx.com:ip:xlslice:1.0 b_02
set_property -dict {CONFIG.DIN_TO 16 CONFIG.DIN_FROM 23 CONFIG.DOUT_WIDTH 8} [get_bd_cells b_02]
create_bd_cell -type ip -vlnv xilinx.com:ip:xlconcat:2.1 xlconcat_2
set_property -dict {CONFIG.NUM_PORTS 3 CONFIG.IN0_WIDTH 8 CONFIG.IN1_WIDTH 8} [get_bd_cells xlconcat_2]
create_bd_cell -type ip -vlnv xilinx.com:ip:xlslice:1.0 b_03
set_property -dict {CONFIG.DIN_TO 24 CONFIG.DIN_FROM 31 CONFIG.DOUT_WIDTH 8} [get_bd_cells b_03]
create_bd_cell -type ip -vlnv xilinx.com:ip:xlconstant:1.1 xlconstant_2
set_property -dict {CONFIG.CONST_VAL 0} [get_bd_cells xlconstant_2]
create_bd_cell -type ip -vlnv xilinx.com:ip:xlconcat:2.1 xlconcat_3
set_property -dict {CONFIG.NUM_PORTS 3 CONFIG.IN0_WIDTH 8 CONFIG.IN1_WIDTH 8} [get_bd_cells xlconcat_3]
create_bd_cell -type ip -vlnv xilinx.com:ip:xlconcat:2.1 xlconcat_4
set_property -dict {CONFIG.NUM_PORTS 3 CONFIG.IN0_WIDTH 8 CONFIG.IN1_WIDTH 8} [get_bd_cells xlconcat_4]
create_bd_cell -type ip -vlnv xilinx.com:ip:xlconcat:2.1 xlconcat_6
set_property -dict {CONFIG.NUM_PORTS 3 CONFIG.IN0_WIDTH 8 CONFIG.IN1_WIDTH 8} [get_bd_cells xlconcat_6]
create_bd_cell -type ip -vlnv xilinx.com:ip:xlconcat:2.1 xlconcat_7
set_property -dict {CONFIG.NUM_PORTS 3 CONFIG.IN0_WIDTH 8 CONFIG.IN1_WIDTH 8} [get_bd_cells xlconcat_7]
create_bd_cell -type ip -vlnv xilinx.com:ip:xlconcat:2.1 xlconcat_8
set_property -dict {CONFIG.NUM_PORTS 3 CONFIG.IN0_WIDTH 8 CONFIG.IN1_WIDTH 8} [get_bd_cells xlconcat_8]
create_bd_cell -type ip -vlnv xilinx.com:ip:xlslice:1.0 b_10
set_property -dict {CONFIG.DIN_FROM 7 CONFIG.DOUT_WIDTH 8} [get_bd_cells b_10]
create_bd_cell -type ip -vlnv xilinx.com:ip:xlconcat:2.1 xlconcat_5
set_property -dict {CONFIG.NUM_PORTS 3 CONFIG.IN0_WIDTH 8 CONFIG.IN1_WIDTH 8} [get_bd_cells xlconcat_5]
create_bd_cell -type ip -vlnv xilinx.com:ip:util_vector_logic:2.0 util_vector_logic_1
set_property -dict {CONFIG.C_SIZE 1} [get_bd_cells util_vector_logic_1]
create_bd_cell -type ip -vlnv xilinx.com:ip:xlslice:1.0 xlslice_5
set_property -dict {CONFIG.DIN_FROM 1 CONFIG.DOUT_WIDTH 2} [get_bd_cells xlslice_5]
create_bd_cell -type ip -vlnv xilinx.com:ip:util_reduced_logic:2.0 util_reduced_logic_1
set_property -dict {CONFIG.C_SIZE 30 CONFIG.C_OPERATION or} [get_bd_cells util_reduced_logic_1]
create_bd_cell -type ip -vlnv xilinx.com:ip:xlslice:1.0 xlslice_7
set_property -dict {CONFIG.DIN_TO 2 CONFIG.DIN_FROM 31 CONFIG.DOUT_WIDTH 30} [get_bd_cells xlslice_7]
create_bd_cell -type ip -vlnv xilinx.com:ip:xlconcat:2.1 xlconcat_9
set_property -dict {CONFIG.IN0_WIDTH 2} [get_bd_cells xlconcat_9]
create_bd_cell -type ip -vlnv xilinx.com:ip:xlslice:1.0 xlslice_0
set_property -dict {CONFIG.DIN_TO 0 CONFIG.DIN_FROM 17 CONFIG.DIN_WIDTH 19 CONFIG.DOUT_WIDTH 18} [get_bd_cells xlslice_0]
create_bd_cell -type ip -vlnv xilinx.com:ip:xlslice:1.0 xlslice_1
set_property -dict {CONFIG.DIN_TO 0 CONFIG.DIN_FROM 17 CONFIG.DIN_WIDTH 19 CONFIG.DOUT_WIDTH 18} [get_bd_cells xlslice_1]
create_bd_cell -type ip -vlnv xilinx.com:ip:util_vector_logic:2.0 util_vector_logic_0
set_property -dict {CONFIG.C_SIZE 1 CONFIG.C_OPERATION or} [get_bd_cells util_vector_logic_0]
create_bd_cell -type ip -vlnv xilinx.com:ip:util_vector_logic:2.0 util_vector_logic_2
set_property -dict {CONFIG.C_SIZE 1 CONFIG.C_OPERATION or} [get_bd_cells util_vector_logic_2]

# ---- hierarchy /datapath/err_pair ----
current_bd_instance /datapath/err_pair
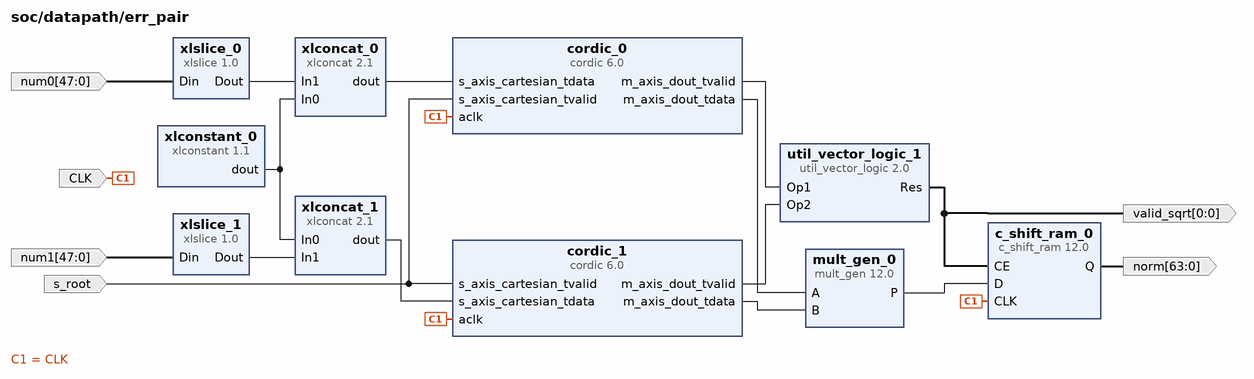
[diagram p11: block diagram inside /datapath/err_pair]
create_bd_pin -dir O -from 0 -to 0 valid_sqrt
create_bd_pin -dir I -type clk CLK
create_bd_pin -dir I s_root
create_bd_pin -dir I -from 47 -to 0 num0
create_bd_pin -dir I -from 47 -to 0 num1
create_bd_pin -dir O -from 63 -to 0 norm

create_bd_cell -type ip -vlnv xilinx.com:ip:util_vector_logic:2.0 util_vector_logic_1
set_property -dict {CONFIG.C_SIZE 1} [get_bd_cells util_vector_logic_1]
create_bd_cell -type ip -vlnv xilinx.com:ip:c_shift_ram:12.0 c_shift_ram_0
set_property -dict [list \
  CONFIG.CE true \
  CONFIG.Width 64 \
  CONFIG.Depth 1 \
  CONFIG.DefaultData 0000000000000000000000000000000000000000000000000000000000000000 \
  CONFIG.AsyncInitVal 0000000000000000000000000000000000000000000000000000000000000000 \
  CONFIG.SCLR true \
] [get_bd_cells c_shift_ram_0]
create_bd_cell -type ip -vlnv xilinx.com:ip:cordic:6.0 cordic_0
set_property -dict [list \
  CONFIG.Functional_Selection Square_Root \
  CONFIG.Pipelining_Mode Maximum \
  CONFIG.Data_Format UnsignedInteger \
  CONFIG.Input_Width 48 \
  CONFIG.Output_Width 25 \
  CONFIG.Coarse_Rotation false \
] [get_bd_cells cordic_0]
create_bd_cell -type ip -vlnv xilinx.com:ip:cordic:6.0 cordic_1
set_property -dict [list \
  CONFIG.Functional_Selection Square_Root \
  CONFIG.Pipelining_Mode Maximum \
  CONFIG.Data_Format UnsignedInteger \
  CONFIG.Input_Width 48 \
  CONFIG.Output_Width 25 \
  CONFIG.Coarse_Rotation false \
] [get_bd_cells cordic_1]
create_bd_cell -type ip -vlnv xilinx.com:ip:mult_gen:12.0 mult_gen_0
set_property -dict [list \
  CONFIG.PortAType Unsigned \
  CONFIG.PortAWidth 32 \
  CONFIG.PortBType Unsigned \
  CONFIG.PortBWidth 32 \
  CONFIG.Multiplier_Construction Use_LUTs \
  CONFIG.PipeStages 0 \
] [get_bd_cells mult_gen_0]
create_bd_cell -type ip -vlnv xilinx.com:ip:xlslice:1.0 xlslice_0
set_property -dict {CONFIG.DIN_TO 0 CONFIG.DIN_FROM 39 CONFIG.DIN_WIDTH 48 CONFIG.DOUT_WIDTH 40} [get_bd_cells xlslice_0]
create_bd_cell -type ip -vlnv xilinx.com:ip:xlconcat:2.1 xlconcat_0
set_property -dict {CONFIG.IN0_WIDTH 8 CONFIG.IN1_WIDTH 40} [get_bd_cells xlconcat_0]
create_bd_cell -type ip -vlnv xilinx.com:ip:xlconstant:1.1 xlconstant_0
set_property -dict {CONFIG.CONST_WIDTH 8 CONFIG.CONST_VAL 0} [get_bd_cells xlconstant_0]
create_bd_cell -type ip -vlnv xilinx.com:ip:xlconcat:2.1 xlconcat_1
set_property -dict {CONFIG.IN0_WIDTH 8 CONFIG.IN1_WIDTH 40} [get_bd_cells xlconcat_1]
create_bd_cell -type ip -vlnv xilinx.com:ip:xlslice:1.0 xlslice_1
set_property -dict {CONFIG.DIN_TO 0 CONFIG.DIN_FROM 39 CONFIG.DIN_WIDTH 48 CONFIG.DOUT_WIDTH 40} [get_bd_cells xlslice_1]

# ---- hierarchy /datapath/zncc_cont ----
current_bd_instance /datapath/zncc_cont
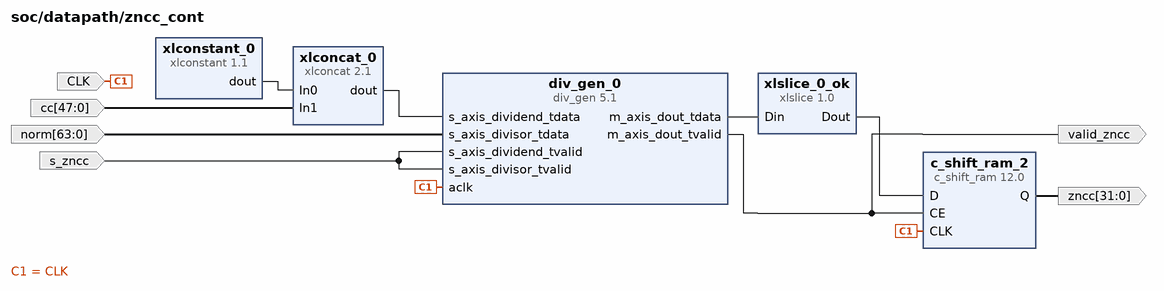
[diagram p12: block diagram inside /datapath/zncc_cont]
create_bd_pin -dir I s_zncc
create_bd_pin -dir I -from 63 -to 0 norm
create_bd_pin -dir I -from 47 -to 0 cc
create_bd_pin -dir O valid_zncc
create_bd_pin -dir O -from 31 -to 0 zncc
create_bd_pin -dir I CLK

create_bd_cell -type ip -vlnv xilinx.com:ip:xlconcat:2.1 xlconcat_0
set_property -dict {CONFIG.NUM_PORTS 2 CONFIG.IN0_WIDTH 16 CONFIG.IN1_WIDTH 48} [get_bd_cells xlconcat_0]
create_bd_cell -type ip -vlnv xilinx.com:ip:xlconstant:1.1 xlconstant_0
set_property -dict {CONFIG.CONST_WIDTH 16 CONFIG.CONST_VAL 0} [get_bd_cells xlconstant_0]
create_bd_cell -type ip -vlnv xilinx.com:ip:xlslice:1.0 xlslice_0_ok
set_property -dict {CONFIG.DIN_TO 18 CONFIG.DIN_FROM 49 CONFIG.DIN_WIDTH 88 CONFIG.DOUT_WIDTH 32} [get_bd_cells xlslice_0_ok]
create_bd_cell -type ip -vlnv xilinx.com:ip:c_shift_ram:12.0 c_shift_ram_2
set_property -dict [list \
  CONFIG.CE true \
  CONFIG.Width 32 \
  CONFIG.Depth 1 \
  CONFIG.DefaultData 00000000000000000000000000000000 \
  CONFIG.AsyncInitVal 00000000000000000000000000000000 \
] [get_bd_cells c_shift_ram_2]
create_bd_cell -type ip -vlnv xilinx.com:ip:div_gen:5.1 div_gen_0
set_property -dict [list \
  CONFIG.algorithm_type High_Radix \
  CONFIG.dividend_and_quotient_width 64 \
  CONFIG.divisor_width 64 \
  CONFIG.remainder_type Fractional \
  CONFIG.fractional_width 18 \
  CONFIG.FlowControl NonBlocking \
  CONFIG.latency 44 \
] [get_bd_cells div_gen_0]

# ---- hierarchy /datapath/bram_res ----
current_bd_instance /datapath/bram_res
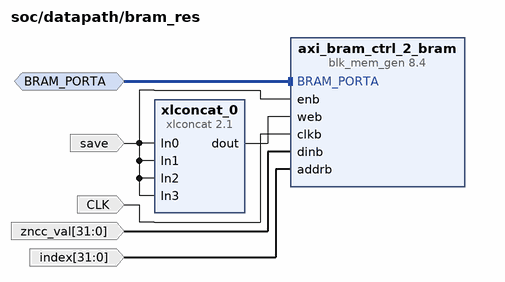
[diagram p13: block diagram inside /datapath/bram_res]
create_bd_intf_pin -mode Slave -vlnv xilinx.com:interface:bram_rtl:1.0 BRAM_PORTA
create_bd_pin -dir I -from 31 -to 0 index
create_bd_pin -dir I CLK
create_bd_pin -dir I -from 31 -to 0 zncc_val
create_bd_pin -dir I save

create_bd_cell -type ip -vlnv xilinx.com:ip:blk_mem_gen:8.4 axi_bram_ctrl_2_bram
set_property -dict [list \
  CONFIG.Memory_Type True_Dual_Port_RAM \
  CONFIG.Enable_B Use_ENB_Pin \
  CONFIG.Use_RSTB_Pin true \
  CONFIG.Port_B_Clock 100 \
  CONFIG.Port_B_Write_Rate 50 \
  CONFIG.Port_B_Enable_Rate 100 \
] [get_bd_cells axi_bram_ctrl_2_bram]
create_bd_cell -type ip -vlnv xilinx.com:ip:xlconcat:2.1 xlconcat_0
set_property -dict {CONFIG.NUM_PORTS 4} [get_bd_cells xlconcat_0]

# ---- hierarchy /datapath/index_cont ----
current_bd_instance /datapath/index_cont
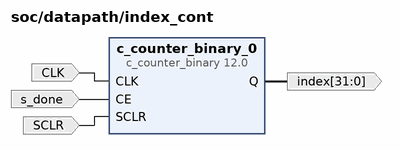
[diagram p14: block diagram inside /datapath/index_cont]
create_bd_pin -dir I -type clk CLK
create_bd_pin -dir I -type ce s_done
create_bd_pin -dir O -from 31 -to 0 -type data index
create_bd_pin -dir I SCLR
